# EasyEDA Pro project CFWatch EasyEDA.epro

# Schematic Main
Board Name: Watch; Create Date: 2025-07-10; Page Name: P1; Project Name: CFWatch EDA Version; Schematic Name: Main; Update Date: 2025-07-13; Company: https://danieldb.uk/; Page Size: A4; Version: V2.0
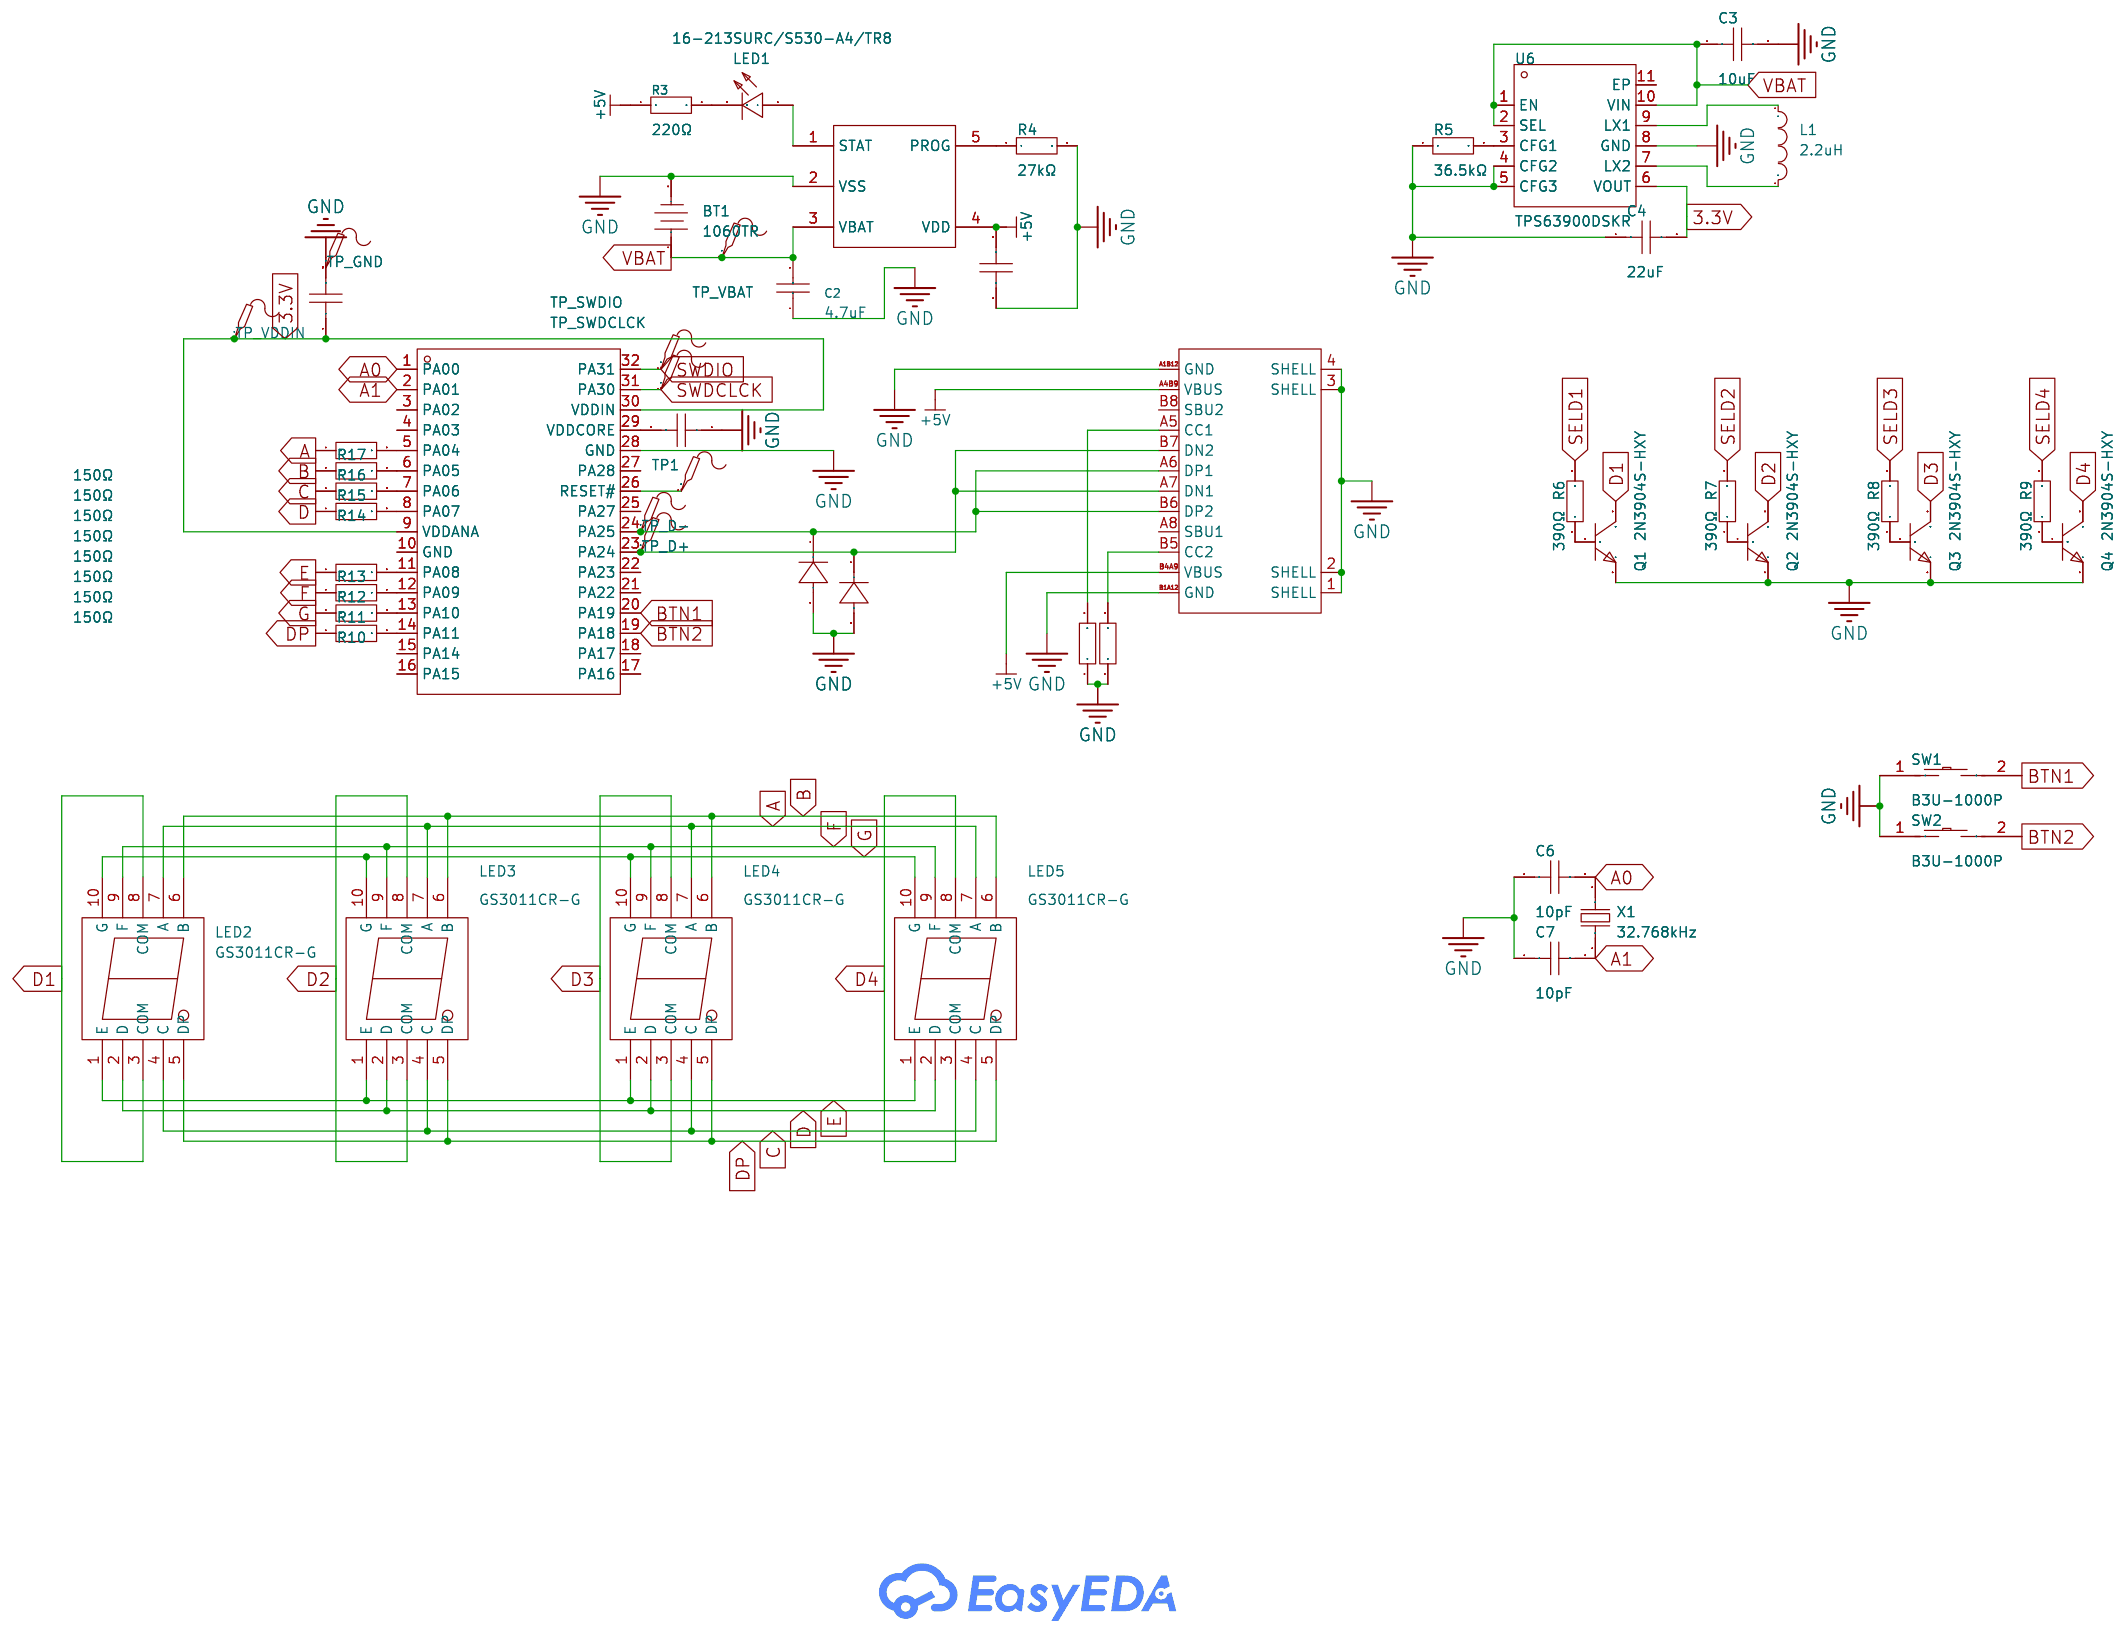
[diagram p0: schematic sheet]

## Parts
BT1  1060TR  [BAT-SMD_1060TR]
C1  1uF  [C0402]
C2  4.7uF  [C0402]
C3  10uF  [C0402]
C4  22uF  [C0402]
C5  1uF  [C0402]
C6  10pF  [C0402]
C7  10pF  [C0402]
C8  1uF  [C0402]
L1  2.2uH  [L0805]
LED1  16-213SURC/S530-A4/TR8  [LED0402-R-RD]
LED2  GS3011CR-G  [LED-SEG-SMD_10P-L12.0-W7.3-P1.50-BL]
LED3  GS3011CR-G  [LED-SEG-SMD_10P-L12.0-W7.3-P1.50-BL]
LED4  GS3011CR-G  [LED-SEG-SMD_10P-L12.0-W7.3-P1.50-BL]
LED5  GS3011CR-G  [LED-SEG-SMD_10P-L12.0-W7.3-P1.50-BL]
Q1  2N3904S-HXY  [SOT-23-3_L3.0-W1.7-P0.95-LS2.9-BR]
Q2  2N3904S-HXY  [SOT-23-3_L3.0-W1.7-P0.95-LS2.9-BR]
Q3  2N3904S-HXY  [SOT-23-3_L3.0-W1.7-P0.95-LS2.9-BR]
Q4  2N3904S-HXY  [SOT-23-3_L3.0-W1.7-P0.95-LS2.9-BR]
R1  5.1kΩ  [R0402]
R2  5.1kΩ  [R0402]
R3  220Ω  [R0402]
R4  27kΩ  [R0402]
R5  36.5kΩ  [R0402]
R6  390Ω  [R0402]
R7  390Ω  [R0402]
R8  390Ω  [R0402]
R9  390Ω  [R0402]
R10  150Ω  [R0402]
R11  150Ω  [R0402]
R12  150Ω  [R0402]
R13  150Ω  [R0402]
R14  150Ω  [R0402]
R15  150Ω  [R0402]
R16  150Ω  [R0402]
R17  150Ω  [R0402]
SW1  B3U-1000P  [KEY-SMD_B3U-1000PM]
SW2  B3U-1000P  [KEY-SMD_B3U-1000PM]
TP1  -  [Test-Point-0.5mm]
TP_D+  -  [Test-Point-0.5mm]
TP_D-  -  [Test-Point-0.5mm]
TP_GND  -  [Test-Point-0.5mm]
TP_SWDCLCK  -  [Test-Point-0.5mm]
TP_SWDIO  -  [Test-Point-0.5mm]
TP_VBAT  -  [Test-Point-0.5mm]
TP_VDDIN  -  [Test-Point-0.5mm]
U1  ATSAMD21E18A-AF  [TQFP-32_L7.0-W7.0-P0.80-LS9.0-BL]
U2  GT-USB-7010ASV  [USB-C-SMD_G-SWITCH_GT-USB-7010ASV]
U3  1N5819WS  [SOD-323_L1.8-W1.3-LS2.5-RD]
U4  1N5819WS  [SOD-323_L1.8-W1.3-LS2.5-RD]
U5  MCP73831T-2ATI/OT  [SOT-23-5_L3.0-W1.7-P0.95-LS2.8-BR]
U6  TPS63900DSKR  [WSON-10_L2.5-W2.5-W0.50-TL-EP]
X1  32.768kHz  [FC-135R_L3.2-W1.5]

## Library data of the parts
BT1 = 1060TR: Supplier Part: C238069; Manufacturer: Keystone; Supplier Footprint: SMD; JLCPCB Part Class: Extended Part; Datasheet: https://atta.szlcsc.com/upload/public/pdf/source/20230320/C1BE6CFA374F9ACD78161F1E1BA128C8.pdf; Supplier: LCSC
C1 C5 C8 = CL05A105KA5NQNC: Capacitance: Tolerance:±10% Tolerance:±10% Voltage Rated: Temperature Coefficient:; LCSC Part Name: 1uF ±10% 25V; Supplier Part: C52923; Manufacturer: SAMSUNG(三星); Supplier Footprint: 0402; JLCPCB Part Class: Basic Part; Datasheet: https://atta.szlcsc.com/upload/public/pdf/source/20160218/1457707763339.pdf; Supplier: LCSC; Tolerance: ±10%
C2 = CL05A475MP5NRNC: Capacitance: Tolerance:±20% Tolerance:±20% Voltage Rated: Temperature Coefficient:; LCSC Part Name: 4.7uF ±20% 10V; Supplier Part: C23733; Manufacturer: SAMSUNG(三星); Supplier Footprint: 0402; JLCPCB Part Class: Basic Part; Datasheet: https://atta.szlcsc.com/upload/public/pdf/source/20160218/1457707763339.pdf; Supplier: LCSC; Tolerance: ±20%
C3 = CGA0402X5R106M6R3GT: Capacitance:10uF Tolerance:±20% Tolerance:±20% Voltage Rating:6.3V Temperature Coefficient:X5R; LCSC Part Name: 10uF ±20% 6.3V; Supplier Part: C23692971; Manufacturer: HRE(芯声); Supplier Footprint: 0402; JLCPCB Part Class: Extended Part; Datasheet: https://atta.szlcsc.com/upload/public/pdf/source/20240628/801259D62E9C0558A4A5987807C4BB80.pdf; Supplier: LCSC; Tolerance: ±20%; Voltage Rating: 6.3V; Temperature Coefficient: X5R
C4 = GRM155R60J226ME11D: Capacitance:22uF Tolerance:±20% Tolerance:±20% Voltage Rating:6.3V Temperature Coefficient:X5R; LCSC Part Name: 22uF ±20% 6.3V; Supplier Part: C415703; Manufacturer: muRata(村田); Supplier Footprint: 0402; JLCPCB Part Class: Extended Part; Datasheet: https://atta.szlcsc.com/upload/public/pdf/source/20200305/C490387_23319AE8C154DEB24C505E6C82A8106A.pdf; Supplier: LCSC; Tolerance: ±20%; Voltage Rating: 6.3V; Temperature Coefficient: X5R
C6 C7 = CL05C100JB5NNNC: Capacitance: Tolerance:±5% Tolerance:±5% Voltage Rated: Temperature Coefficient:; LCSC Part Name: 10pF ±5% 50V; Supplier Part: C32949; Manufacturer: SAMSUNG(三星); Supplier Footprint: 0402; JLCPCB Part Class: Basic Part; Datasheet: https://atta.szlcsc.com/upload/public/pdf/source/20160218/1457707763339.pdf; Supplier: LCSC; Tolerance: ±5%
L1 = CMI201209U2R2KT: Inductance: Tolerance:±10% Tolerance:±10% Rated Current: Saturation Current (Isat):- DC Resistance (DCR): Q @ Freq:35@10MHz Frequency - Self Resonant: Ratings:; LCSC Part Name: 2.2uH ±10%; Supplier Part: C1043; Manufacturer: FH(风华); Supplier Footprint: 0805; JLCPCB Part Class: Extended Part; Datasheet: https://atta.szlcsc.com/upload/public/pdf/source/20230223/B5A9234764BD8EE53116685FAFCB16FA.pdf; Supplier: LCSC; Tolerance: ±10%; Q @ Freq: 35@10MHz
LED1 = 16-213SURC/S530-A4/TR8: Emitted Color:Red Power Dissipation:60mW Forward Current:20mA Dominant Wavelength:624nm Dominant Wavelength:624nm Peak Wavelength:632nm Diode Configuration:- Lens Color:无色透明透镜 Color Temperature:- Color Temperature:- Viewing Angle:120° Mounting Sytle:- Ope; LCSC Part Name: 红灯; Supplier Part: C74339; Manufacturer: EVERLIGHT(亿光); Supplier Footprint: 0402; JLCPCB Part Class: Extended Part; Datasheet: https://atta.szlcsc.com/upload/public/pdf/source/20160606/1465200212356.pdf; Supplier: LCSC; Emitted Color: Red; Power Dissipation: 60mW; Forward Current: 20mA; Dominant Wavelength: 624nm; Peak Wavelength: 632nm; Lens Color: 无色透明透镜; Viewing Angle: 120°; Operating Temperature: -40℃~+85℃
LED2-LED5 = GS3011CR-G: LCSC Part Name: LED贴片数码管; Supplier Part: C22462656; Manufacturer: Guangcai Display(光彩显示); Supplier Footprint: SMD,12x7.3mm; JLCPCB Part Class: Extended Part; Datasheet: https://atta.szlcsc.com/upload/public/pdf/source/20240611/2CC424320ED31D8FCA413C3BDF91AB39.pdf; Supplier: LCSC
Q1-Q4 = 2N3904S-HXY: Current - Collector(Ic):200mA Collector - Emitter Voltage VCEO:40V Pd - Power Dissipation:200mW DC Current Gain:300@10mA,1V DC Current Gain:300@10mA,1V Transition frequency(fT):300MHz Current - Collector Cutoff:100nA Vce Saturation(VCE(sat)):300mV@50mA,5m; Supplier Part: C46682376; Manufacturer: HXY MOSFET(华轩阳电子); Supplier Footprint: SOT-23; JLCPCB Part Class: Extended Part; Datasheet: https://atta.szlcsc.com/upload/public/pdf/source/20250320/D303C420EA3A961FEE131A42C1542DAF.pdf; Supplier: LCSC; Current - Collector(Ic): 200mA; Collector - Emitter Voltage VCEO: 40V; Pd - Power Dissipation: 200mW; DC Current Gain: 300@10mA,1V; Transition frequency(fT): 300MHz; Current - Collector Cutoff: 100nA; Vce Saturation(VCE(sat)): 300mV@50mA,5mA; Emitter-Base Voltage(Vebo): 6V
R1 R2 = 0402WGF5101TCE: Type:Thick Film Resistors Resistance:5.1kΩ Tolerance:±1% Tolerance:±1% Power(Watts): Overload Voltage (Max): Temperature Coefficient:±100ppm/℃ Temperature Coefficient:±100ppm/℃ Operating Temperature Range:-55℃~+155℃ Operating Temperature Range:-55℃~+155℃; LCSC Part Name: 5.1kΩ ±1% 62.5mW 厚膜电阻; Supplier Part: C25905; Manufacturer: UNI-ROYAL(厚声); Supplier Footprint: 0402; JLCPCB Part Class: Basic Part; Datasheet: https://atta.szlcsc.com/upload/public/pdf/source/20200306/C422600_1E6D84923E4A46A82E41ADD87F860B5C.pdf; Supplier: LCSC; Type: Thick Film Resistors; Tolerance: ±1%; Temperature Coefficient: ±100ppm/℃; Operating Temperature Range: -55℃~+155℃
R3 = 0402WGF2200TCE: Type:Thick Film Resistors Resistance: Tolerance:±1% Tolerance:±1% Power(Watts): Overload Voltage (Max): Temperature Coefficient:±100ppm/℃ Temperature Coefficient:±100ppm/℃ Operating Temperature Range:-55℃~+155℃ Operating Temperature Range:-55℃~+155℃; LCSC Part Name: 220Ω ±1% 62.5mW 厚膜电阻; Supplier Part: C25091; Manufacturer: UNI-ROYAL(厚声); Supplier Footprint: 0402; JLCPCB Part Class: Basic Part; Datasheet: https://atta.szlcsc.com/upload/public/pdf/source/20200306/C422600_1E6D84923E4A46A82E41ADD87F860B5C.pdf; Supplier: LCSC; Type: Thick Film Resistors; Tolerance: ±1%; Temperature Coefficient: ±100ppm/℃; Operating Temperature Range: -55℃~+155℃
R4 = 0402WGF2702TCE: Type:Thick Film Resistors Resistance:27kΩ Tolerance:±1% Tolerance:±1% Power(Watts): Overload Voltage (Max): Temperature Coefficient:±100ppm/℃ Temperature Coefficient:±100ppm/℃ Operating Temperature Range:-55℃~+155℃ Operating Temperature Range:-55℃~+155℃; LCSC Part Name: 27kΩ ±1% 62.5mW 厚膜电阻; Supplier Part: C25771; Manufacturer: UNI-ROYAL(厚声); Supplier Footprint: 0402; JLCPCB Part Class: Extended Part; Datasheet: https://atta.szlcsc.com/upload/public/pdf/source/20200306/C422600_1E6D84923E4A46A82E41ADD87F860B5C.pdf; Supplier: LCSC; Type: Thick Film Resistors; Tolerance: ±1%; Temperature Coefficient: ±100ppm/℃; Operating Temperature Range: -55℃~+155℃
R5 = RC0402FR-0736K5L: Type:Thick Film Resistors Resistance:36.5kΩ Tolerance:±1% Tolerance:±1% Power(Watts):62.5mW Voltage-Supply(Max):50V Temperature Coefficient:±100ppm/℃ Temperature Coefficient:±100ppm/℃ Operating Temperature:-55℃~+155℃ Operating Temperature:-55℃~+155℃; LCSC Part Name: 厚膜电阻 36.5kΩ ±1% 62.5mW; Supplier Part: C15011; Manufacturer: YAGEO(国巨); Supplier Footprint: 0402; JLCPCB Part Class: Extended Part; Datasheet: https://atta.szlcsc.com/upload/public/pdf/source/20170925/C131467_1506321478108990263.pdf; Supplier: LCSC; Type: Thick Film Resistors; Tolerance: ±1%; Power(Watts): 62.5mW; Voltage-Supply(Max): 50V; Temperature Coefficient: ±100ppm/℃; Operating Temperature: -55℃~+155℃
R6-R9 = RC0402FR-07390RL: Type:Thick Film Resistors Resistance: Tolerance:±1% Tolerance:±1% Power(Watts): Overload Voltage (Max): Temperature Coefficient:±100ppm/℃ Temperature Coefficient:±100ppm/℃ Operating Temperature Range:-55℃~+155℃ Operating Temperature Range:-55℃~+155℃; LCSC Part Name: 厚膜电阻 390Ω ±1% 62.5mW; Supplier Part: C137997; Manufacturer: YAGEO(国巨); Supplier Footprint: 0402; JLCPCB Part Class: Extended Part; Datasheet: https://atta.szlcsc.com/upload/public/pdf/source/20181009/C309620_DA5935B6E1D48212CB7A533FE518B3C2.pdf; Supplier: LCSC; Type: Thick Film Resistors; Tolerance: ±1%; Temperature Coefficient: ±100ppm/℃; Operating Temperature Range: -55℃~+155℃
R10-R17 = RC0402FR-07150RL: Type:Thick Film Resistors Resistance: Tolerance:±1% Tolerance:±1% Power(Watts): Overload Voltage (Max): Temperature Coefficient:±100ppm/℃ Temperature Coefficient:±100ppm/℃ Operating Temperature Range:-55℃~+155℃ Operating Temperature Range:-55℃~+155℃; LCSC Part Name: 厚膜电阻 150Ω ±1% 62.5mW; Supplier Part: C138054; Manufacturer: YAGEO(国巨); Supplier Footprint: 0402; JLCPCB Part Class: Extended Part; Datasheet: https://atta.szlcsc.com/upload/public/pdf/source/20180821/C275644_0D56F95EFF785E7D9A1FEF436B37DA78.pdf; Supplier: LCSC; Type: Thick Film Resistors; Tolerance: ±1%; Temperature Coefficient: ±100ppm/℃; Operating Temperature Range: -55℃~+155℃
SW1 SW2 = B3U-1000P_C231329: Circuit:SPST Actuator Style:Round Button Operating Force:153gf Mounting Style:Standing paste Switch Length:3mm Switch Width:2.5mm Switch Height:1.6mm Contact Current:50mA Voltage Rating (DC):12V With Lamp:- Pin Style:SMDSplicing Mechanical Life:- Operatin; LCSC Part Name: 3*2.5*1.6mm 立贴 轻触开关; Supplier Part: C231329; Manufacturer: OMRON(欧姆龙); Supplier Footprint: SMD,2.5x3mm; JLCPCB Part Class: Extended Part; Supplier: LCSC; Circuit: SPST; Actuator Style: Round Button; Operating Force: 153gf; Mounting Style: Standing paste; Switch Length: 3mm; Switch Width: 2.5mm; Switch Height: 1.6mm; Contact Current: 50mA; Voltage Rating (DC): 12V; Pin Style: SMDSplicing; Operating Temperature: -25℃~+70℃
TP1 TP_D+ TP_D- TP_GND TP_SWDCLCK TP_SWDIO TP_VBAT TP_VDDIN = Test-Point: Test Point 测试点
U1 = ATSAMD21E18A-AF_C618770: CPU Core:ARM-MSeries Program Storage Size:256KB GPIO Ports Number:26 Operating Voltage Range:1.62V~3.6V Operating Voltage Range:1.62V~3.6V CPU Maximum Speed:48MHz Operating Temperature Range:-40℃~+125℃ Operating Temperature Range:-40℃~+125℃ ADC (Bit):12bi; Supplier Part: C618770; Manufacturer: MICROCHIP(美国微芯); Supplier Footprint: TQFP-32(7x7); JLCPCB Part Class: Extended Part; Datasheet: https://atta.szlcsc.com/upload/public/pdf/source/20221014/F65C30D4DC53CEBA3C02B22F35E14B22.pdf; Supplier: LCSC; CPU Core: ARM-MSeries; Program Storage Size: 256KB; GPIO Ports Number: 26; Operating Voltage Range: 1.62V~3.6V; CPU Maximum Speed: 48MHz; Operating Temperature Range: -40℃~+125℃; ADC (Bit): 12bit; DAC (Bit): 10bit; Universal Serial Bus: 有; Watchdog: 有; Low-Voltage Detect: 有; Direct Memory Access: 有; Internal Oscillator: 有
U2 = GT-USB-7010ASV: Connector Type:Type-C Standard:USB 2.0 Gender:Female Mounting Style:Horizontal attachment Number of Contacts:16P Number of Ports:1 Current Rating - Power (Max):3A Rated Voltage (Max):24V Connect-Disconnect Life:10,000 times Center Height:1.68mm Length:7.3; LCSC Part Name: Type-C 母 卧贴; Supplier Part: C2988369; Manufacturer: G-Switch(品赞); Supplier Footprint: SMD; JLCPCB Part Class: Extended Part; Datasheet: https://atta.szlcsc.com/upload/public/pdf/source/20230327/DF227B64686AC8FA0AD1775797F2C3F1.pdf; Supplier: LCSC; Connector Type: Type-C; Standard: USB 2.0; Gender: Female; Mounting Style: Horizontal attachment; Number of Contacts: 16P; Number of Ports: 1; Current Rating - Power (Max): 3A; Rated Voltage (Max): 24V; Connect-Disconnect Life: 10,000 times; Center Height: 1.68mm; Length: 7.35mm; Core Colour: Black; Operating Temperature Range: -40℃~+85℃
U3 U4 = 1N5819WS_C5451629: Diode Configuration:Independent Type Forward Voltage (Vf@If):600mV@200mA Reverse Voltage (Vr):40V Rectified Current:350mA Reverse Leakage Current (Ir):5uA@30V; LCSC Part Name: 电压:40V 电流:350mA; Supplier Part: C5451629; Manufacturer: HXY MOSFET(华轩阳电子); Supplier Footprint: SOD-323; JLCPCB Part Class: Extended Part; Datasheet: https://atta.szlcsc.com/upload/public/pdf/source/20241210/E09529DC3911EEA68F8C7E42E992A25B.pdf; Supplier: LCSC; Diode Configuration: Independent Type; Forward Voltage (Vf@If): 600mV@200mA; Reverse Voltage (Vr): 40V; Rectified Current: 350mA; Reverse Leakage Current (Ir): 5uA@30V
U5 = MCP73831T-2ATI/OT: The Chip Type:- Voltage - Supply:3.75V~6V Voltage - Supply:3.75V~6V Charge Current - Max:- Charging Saturation Voltage:4.2V Type of Battery:Lithium-ion/Polymer Number of Cells:1 Number of Cells:1 Operating Temperature:-40℃~+85℃ Operating Temperature:-40℃~; Supplier Part: C14879; Manufacturer: MICROCHIP(美国微芯); Supplier Footprint: SOT-23-5; JLCPCB Part Class: Extended Part; Datasheet: https://atta.szlcsc.com/upload/public/pdf/source/20171228/C150772_15144473662971214910.pdf; Supplier: LCSC; Voltage - Supply: 3.75V~6V; Charging Saturation Voltage: 4.2V; Type of Battery: Lithium-ion/Polymer; Number of Cells: 1; Operating Temperature: -40℃~+85℃
U6 = TPS63900DSKR: Input Voltage:1.8V~5.5V Input Voltage:1.8V~5.5V Output Current:400mA Switching Frequency:- Switching Frequency:- Operating Temperature:-40℃~+125℃@(TJ) Operating Temperature:-40℃~+125℃@(TJ) Synchronous Rectification:Yes Number of Outputs:- Topology:Step-do; LCSC Part Name: 1.8V至5.5V,75nA超低静态电流同步升降压转换器; Supplier Part: C1518762; Manufacturer: TI(德州仪器); Supplier Footprint: WSON-10-EP(2.5x2.5); JLCPCB Part Class: Extended Part; Datasheet: https://www.ti.com/cn/lit/gpn/tps63900; Supplier: LCSC; Input Voltage: 1.8V~5.5V; Output Current: 400mA; Operating Temperature: -40℃~+125℃@(TJ); Synchronous Rectification: Yes; Topology: Step-down-Boost
X1 = Q13FC13500004_C32346: Crystal Type:Surface Mount Crystal Frequency: Normal temperature Frequency Tolerance:±20ppm Normal temperature Frequency Tolerance:±20ppm Load Capacitor: Equivalent Series Resistance (ESR):70kΩ Operating Temperature: Operating Temperature:; LCSC Part Name: 32.768kHz ±20ppm 12.5pF; Supplier Part: C32346; Manufacturer: EPSON(爱普生); Manufacturer Part: Q13FC13500004; Supplier Footprint: SMD3215-2P; JLCPCB Part Class: Basic Part; Datasheet: https://atta.szlcsc.com/upload/public/pdf/source/20240418/0E0FF5F0356BA3753F616001439D1416.pdf; Supplier: LCSC; Crystal Type: Surface Mount Crystal; Normal temperature Frequency Tolerance: ±20ppm; Equivalent Series Resistance (ESR): 70kΩ

## Nets
3.3V: C4.2 C5.1 TP_VDDIN.1 U1.9(VDDANA) U1.30(VDDIN) U6.6(VOUT)
+5V: C1.2 R3.1 U2.A4B9(VBUS) U2.B4A9(VBUS) U5.4(VDD)
GND: BT1.2(-) C1.1 C2.1 C3.2 C4.1 C5.2 C6.1 C7.1 C8.1 Q1.2(E) Q2.2(E) Q3.2(E) Q4.2(E) R1.1 R2.1 R4.2 R5.1 SW1.1 SW2.1 U1.28(GND) U2.1(SHELL) U2.2(SHELL) U2.3(SHELL) U2.4(SHELL) U2.A1B12(GND) U2.B1A12(GND) U3.2(A) U4.2(A) U5.2(VSS) U6.4(CFG2) U6.5(CFG3) U6.8(GND)
VBAT: BT1.1(+) C2.2 C3.1 TP_VBAT.1 U5.3(VBAT) U6.1(EN) U6.2(SEL) U6.10(VIN)
A: LED2.7(A) LED3.7(A) LED4.7(A) LED5.7(A) R17.1
A0: C6.2 U1.1(PA00) X1.2
A1: C7.2 U1.2(PA01) X1.1
B: LED2.6(B) LED3.6(B) LED4.6(B) LED5.6(B) R16.1
BTN1: SW1.2 U1.20(PA19)
BTN2: SW2.2 U1.19(PA18)
C: LED2.4(C) LED3.4(C) LED4.4(C) LED5.4(C) R15.1
D: LED2.2(D) LED3.2(D) LED4.2(D) LED5.2(D) R14.1
D1: LED2.3(COM) LED2.8(COM) Q1.3(C)
D2: LED3.3(COM) LED3.8(COM) Q2.3(C)
D3: LED4.3(COM) LED4.8(COM) Q3.3(C)
D4: LED5.3(COM) LED5.8(COM) Q4.3(C)
DP: LED2.5(DP) LED3.5(DP) LED4.5(DP) LED5.5(DP) R10.1
E: LED2.1(E) LED3.1(E) LED4.1(E) LED5.1(E) R13.1
F: LED2.9(F) LED3.9(F) LED4.9(F) LED5.9(F) R12.1
G: LED2.10(G) LED3.10(G) LED4.10(G) LED5.10(G) R11.1
SELD1: R6.2
SELD2: R7.2
SELD3: R8.2
SELD4: R9.2
SWDCLCK: TP_SWDCLCK.1 U1.31(PA30)
SWDIO: TP_SWDIO.1 U1.32(PA31)
$1N465: TP_D+.1 U1.23(PA24) U2.A7(DN1) U2.B7(DN2) U4.1(K)
$1N640: TP_D-.1 U1.24(PA25) U2.A6(DP1) U2.B6(DP2) U3.1(K)
$1N815: R1.2 U2.A5(CC1)
$1N820: R2.2 U2.B5(CC2)
$1N1606: LED1.1(A) U5.1(STAT)
$1N1727: LED1.2(C) R3.2
$1N1834: R4.1 U5.5(PROG)
$1N2220: L1.1 U6.9(LX1)
$1N2226: L1.2 U6.7(LX2)
$1N2443: R5.2 U6.3(CFG1)
$1N4175: R10.2 U1.14(PA11)
$1N4214: R11.2 U1.13(PA10)
$1N4253: R12.2 U1.12(PA09)
$1N4292: R13.2 U1.11(PA08)
$1N4331: R14.2 U1.8(PA07)
$1N4370: R15.2 U1.7(PA06)
$1N4409: R16.2 U1.6(PA05)
$1N4448: R17.2 U1.5(PA04)
$1N5046: TP1.1 U1.26(RESET#)
$1N5217: C8.2 U1.29(VDDCORE)
$1N8340: Q1.1(B) R6.1
$1N8386: Q2.1(B) R7.1
$1N8433: Q3.1(B) R8.1
$1N8480: Q4.1(B) R9.1

Not connected (* = marked no-connect by the designer): TP_GND 1; U1 3(PA02) 4(PA03) 10(GND) 15(PA14) 16(PA15) 17(PA16) 18(PA17) 21(PA22) 22(PA23) 25(PA27) 27(PA28); U2 A8(SBU1) B8(SBU2); U6 11(EP)

# Board PCB1
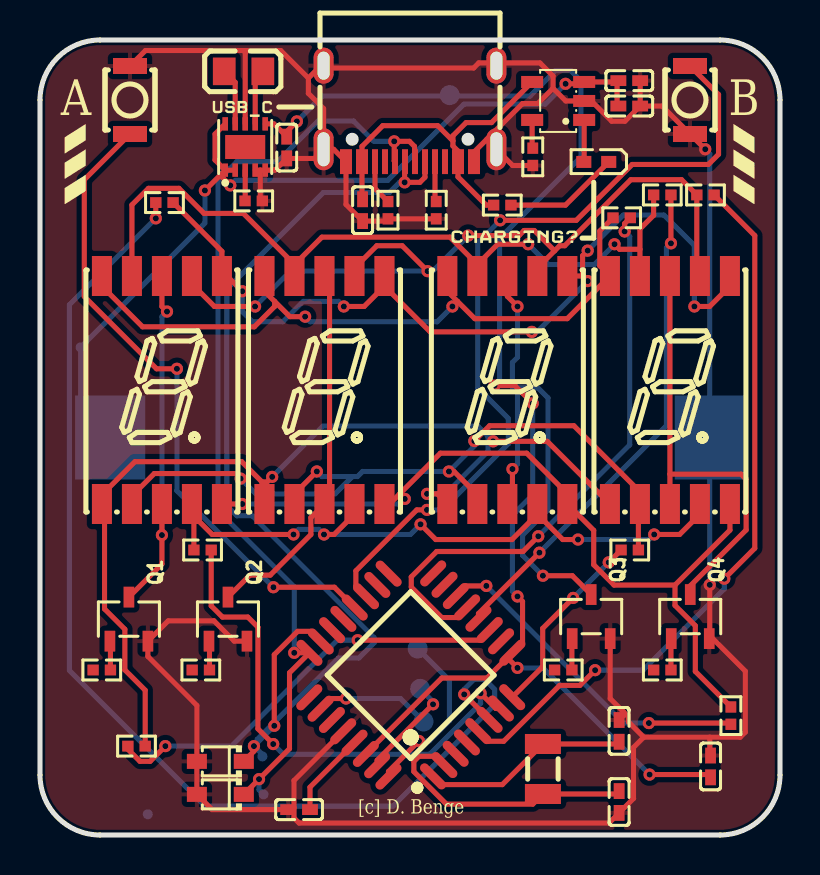
[diagram p1: board, top side]
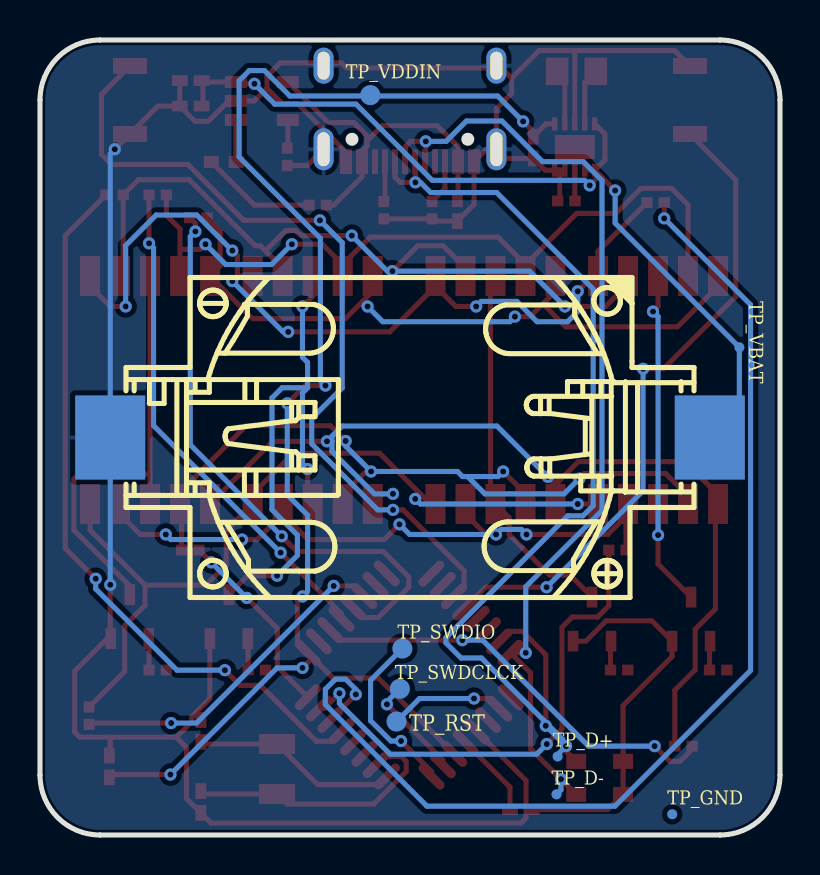
[diagram p2: board, bottom side, seen from below]

Outline 37 x 39.75 mm; copper layers: Top Layer, Bottom Layer. Coordinates in mm from the lower left corner of the outline.
Outline path: 0,36.75 0,3 arc(0.88,0.88) 3,0 34,0 arc(36.12,0.88) 37,3 37,36.75 arc(36.12,38.87) 34,39.75 3,39.75 arc(0.88,38.87) 0,36.75
Stack: Top Layer 0.035mm / Dielectric1 1.51mm FR4 er 4.5 / Bottom Layer 0.035mm

## Design rules (mm)
template: JLCPCB Capability(Two Layers Board)
spacing copperThickness1oz (default): track to track 0.102, other pairs 0.152 to 0.3
spacing copperThickness2oz: track to track 0.203, other pairs 0.152 to 0.3
track width copperThickness1oz (default): min 0.127, default 0.254, max 2.54
track width copperThickness2oz: min 0.203, default 0.254, max 2.54
differential pair differentialPair (default): width min 0.127, default 0.254, max 2.54; gap min 0.152, default 0.152
via viaSize (default): diameter min 0.5, default 0.61, max 10; hole min 0.3, default 0.305, max 6.3

## Placement (name value [footprint] x y rotation side)
BT1  1060TR  [BAT-SMD_1060TR]  18.5 19.88 90 bottom
C1  1uF  [C0402]  16.13 31.24 90 top
C2  4.7uF  [C0402]  29.46 37.72 180 top
C3  10uF  [C0402]  29.46 36.45 0 top
C4  22uF  [C0402]  12.34 34.37 90 top
C5  1uF  [C0402]  33.53 3.43 90 top
C6  10pF  [C0402]  28.96 5.21 270 top
C7  10pF  [C0402]  28.96 1.65 90 top
C8  1uF  [C0402]  12.95 1.27 0 top
L1  2.2uH  [L0805]  10.18 38.18 0 top
LED1  16-213SURC/S530-A4/TR8  [LED0402-R-RD]  27.81 33.65 180 top
LED2  GS3011CR-G  [LED-SEG-SMD_10P-L12.0-W7.3-P1.50-BL]  6.1 22.25 0 top
LED3  GS3011CR-G  [LED-SEG-SMD_10P-L12.0-W7.3-P1.50-BL]  14.22 22.25 0 top
LED4  GS3011CR-G  [LED-SEG-SMD_10P-L12.0-W7.3-P1.50-BL]  23.37 22.25 0 top
LED5  GS3011CR-G  [LED-SEG-SMD_10P-L12.0-W7.3-P1.50-BL]  31.5 22.25 0 top
Q1  2N3904S-HXY  [SOT-23-3_L3.0-W1.7-P0.95-LS2.9-BR]  4.44 10.79 270 top
Q2  2N3904S-HXY  [SOT-23-3_L3.0-W1.7-P0.95-LS2.9-BR]  9.4 10.79 270 top
Q3  2N3904S-HXY  [SOT-23-3_L3.0-W1.7-P0.95-LS2.9-BR]  27.56 10.92 270 top
Q4  2N3904S-HXY  [SOT-23-3_L3.0-W1.7-P0.95-LS2.9-BR]  32.51 10.92 270 top
R1  5.1kΩ  [R0402]  19.81 31.24 90 top
R2  5.1kΩ  [R0402]  17.4 31.24 90 top
R3  220Ω  [R0402]  23.11 31.5 0 top
R4  27kΩ  [R0402]  24.64 33.91 270 top
R5  36.5kΩ  [R0402]  10.69 31.71 180 top
R6  390Ω  [R0402]  3.09 8.25 180 top
R7  390Ω  [R0402]  8.04 8.25 180 top
R8  390Ω  [R0402]  26.16 8.25 180 top
R9  390Ω  [R0402]  31.12 8.25 180 top
R10  150Ω  [R0402]  34.54 5.97 270 top
R11  150Ω  [R0402]  29.08 30.86 0 top
R12  150Ω  [R0402]  31.12 32 0 top
R13  150Ω  [R0402]  4.83 4.44 180 top
R14  150Ω  [R0402]  29.49 14.25 180 top
R15  150Ω  [R0402]  8.13 14.25 0 top
R16  150Ω  [R0402]  6.22 31.62 180 top
R17  150Ω  [R0402]  33.27 32 0 top
SW1  B3U-1000P  [KEY-SMD_B3U-1000PM]  4.5 36.75 270 top
SW2  B3U-1000P  [KEY-SMD_B3U-1000PM]  32.5 36.75 90 top
TP1  -  [Test-Point-0.5mm#2]  19.17 5.67 180 bottom
TP_D+  -  [Test-Point-0.5mm]  11.12 3.93 180 bottom
TP_D-  -  [Test-Point-0.5mm]  11.18 2.03 180 bottom
TP_GND  -  [Test-Point-0.5mm]  5.39 1.04 180 bottom
TP_SWDCLCK  -  [Test-Point-0.5mm#2]  19.01 7.31 180 bottom
TP_SWDIO  -  [Test-Point-0.5mm#2]  18.88 9.32 180 bottom
TP_VBAT  -  [Test-Point-0.5mm]  2.03 24.38 270 bottom
TP_VDDIN  -  [Test-Point-0.5mm#2]  20.49 36.99 180 bottom
U1  ATSAMD21E18A-AF  [TQFP-32_L7.0-W7.0-P0.80-LS9.0-BL]  18.54 8 45 top
U2  GT-USB-7010ASV  [USB-C-SMD_G-SWITCH_GT-USB-7010ASV]  18.5 36.07 180 top
U3  1N5819WS  [SOD-323_L1.8-W1.3-LS2.5-RD]  9.02 2.03 180 top
U4  1N5819WS  [SOD-323_L1.8-W1.3-LS2.5-RD]  9.02 3.68 180 top
U5  MCP73831T-2ATI/OT  [SOT-23-5_L3.0-W1.7-P0.95-LS2.8-BR]  25.91 36.7 0 top
U6  TPS63900DSKR  [WSON-10_L2.5-W2.5-W0.50-TL-EP]  10.26 34.4 90 top
X1  32.768kHz  [FC-135R_L3.2-W1.5]  25.15 3.3 90 top

## Footprints (pads in the part's own frame, mm; a bottom-side part is the same pattern mirrored in y, then rotated)
BAT-SMD_1060TR
  rect 4.2x3.5 smd: 1(0,-14.988) 2(0,14.988)
C0402
  rect 0.79x0.54 smd: 1(-0.545,0) 2(0.545,0)
FC-135R_L3.2-W1.5
  rect 1x1.8 smd: 1(-1.25,0) 2(1.25,0)
KEY-SMD_B3U-1000PM
  rect 0.8x1.7 smd: 1(-1.7,0) 2(1.7,0)
L0805
  rect 1.133x1.377 smd: 1(-0.966,0) 2(0.966,0)
LED0402-R-RD
  rect 0.75x0.6 smd: 1(0.623,0) 2(-0.623,0)
LED-SEG-SMD_10P-L12.0-W7.3-P1.50-BL
  rect 1x2 smd: 1(-3,-5.7) 2(-1.5,-5.7) 3(0,-5.7) 4(1.5,-5.7) 5(3,-5.7) 6(3,5.7) 7(1.5,5.7) 8(0,5.7) 9(-1.5,5.7) 10(-3,5.7)
R0402
  rect 0.566x0.54 smd: 1(-0.433,0) 2(0.433,0)
SOD-323_L1.8-W1.3-LS2.5-RD
  rect 1x0.75 smd: 1(-1.173,0) 2(1.173,0)
SOT-23-3_L3.0-W1.7-P0.95-LS2.9-BR
  rect 1.038x0.532 smd: 1(1.101,-0.95) 2(1.101,0.95) 3(-1.101,0)
SOT-23-5_L3.0-W1.7-P0.95-LS2.8-BR
  rect 1.1x0.6 smd: 1(1.3,-0.95) 2(1.3,0) 3(1.3,0.95) 4(-1.3,0.95) 5(-1.3,-0.95)
Test-Point-0.5mm
  round 0.5 smd: 1(0,0)
Test-Point-0.5mm#2
  round 1 smd: 1(0,0)
TQFP-32_L7.0-W7.0-P0.80-LS9.0-BL
  oval 0.45x1.65 smd: 1(-2.8,-4.369) 2(-2,-4.369) 3(-1.2,-4.369) 4(-0.4,-4.369) 5(0.4,-4.369) 6(1.2,-4.369) 7(2,-4.369) 8(2.8,-4.369) 17(2.8,4.369) 18(2,4.369) 19(1.2,4.369) 20(0.4,4.369) 21(-0.4,4.369) 22(-1.2,4.369) 23(-2,4.369) 24(-2.8,4.369)
  oval 1.65x0.45 smd: 9(4.381,-2.8) 10(4.381,-2) 11(4.381,-1.2) 12(4.381,-0.4) 13(4.381,0.4) 14(4.381,1.2) 15(4.381,2) 16(4.381,2.8) 25(-4.381,2.8) 26(-4.381,2) 27(-4.381,1.2) 28(-4.381,0.4) 29(-4.381,-0.4) 30(-4.381,-1.2) 31(-4.381,-2) 32(-4.381,-2.8)
USB-C-SMD_G-SWITCH_GT-USB-7010ASV
  oval 1x2.1 hole 0.6x1.7: 1(-4.32,1.78) 2(4.32,1.78)
  oval 1x1.8 hole 0.6x1.4: 3(4.32,-2.4) 4(-4.32,-2.4)
  rect 0.6x1.24 smd: A1B12(-3.2,2.4) A4B9(-2.4,2.4) B1A12(3.2,2.4) B4A9(2.4,2.4)
  rect 0.3x1.24 smd: A5(-1.25,2.4) A6(-0.25,2.4) A7(0.25,2.4) A8(1.25,2.4) B5(1.75,2.4) B6(0.75,2.4) B7(-0.75,2.4) B8(-1.75,2.4)
WSON-10_L2.5-W2.5-W0.50-TL-EP
  rect 0.665x0.28 smd: 1(-1.157,1) 2(-1.157,0.5) 3(-1.157,0) 4(-1.157,-0.5) 5(-1.157,-1) 6(1.157,-1) 7(1.157,-0.5) 8(1.157,0) 9(1.157,0.5) 10(1.157,1)
  rect 1.2x2 smd: 11(0,0)

## Nets
As in the schematic.

Pads without a net: TP_GND 1; U1 3 4 10 15 16 17 18 21 22 25 27; U2 A8 B8; U6 11

## Via types
v1: diameter 0.61, hole 0.305, Top Layer to Bottom Layer, 72 vias

## Routing (per net, layer and track width the routed paths; a pad name or vN(x,y) marks a point on that pad's centre or on a via; arc(x,y) is an arc through that point)
3.3V: length 72.5
  Top Layer w0.254: 23.37,8.86 U1.9 24.13,9.63 24.13,11.67 v1(23.87,11.93) ; 23.37,8.86 22.35,7.85 20.09,7.85 U1.30 ; 23.37,8.86 v1(23.87,8.36) ; v1(24.64,21.58) 23.74,22.47 v1(22.73,22.47) ; v1(30.48,3.02) 33.39,3.02 C5.1 ; v1(12.84,35.68) 12.34,35.17 C4.2 11.7,35.56 U6.6
  Bottom Layer w0.254: 20.44,36.95 14.11,36.95 v1(12.84,35.68) ; 20.44,36.95 TP_VDDIN.1 ; 20.44,36.95 24.5,36.95 25.78,38.22 26.54,38.22 27.04,37.71 27.04,33.9 22.98,29.84 22.98,22.73 v1(22.73,22.47) ; v1(23.87,11.93) 23.62,12.18 23.62,15.99 24.64,17.01 v1(24.64,21.58) ; v1(23.87,8.36) 25.14,8.36 v1(30.48,3.02)
+5V: length 17.5
  Top Layer w0.254: U5.4 22.58,35.62 21.31,35.62 20.65,34.96 20.65,34.71 ; 20.65,34.71 20.65,34.45 20.9,34.2 U2.A4B9 20.9,32.91 22.31,31.5 R3.1 ; 20.65,34.71 19.88,35.47 17.14,35.47 16.1,34.43 U2.B4A9 16.1,31.81 C1.2
GND: length 152.6
  Top Layer w0.254: 14.06,38.35 13.93,38.35 13.42,37.84 ; 14.06,38.35 U2.3 ; 14.06,38.35 21.68,38.35 21.94,38.61 22.86,38.61 ; C3.2 31.1,36.45 SW2.1 v1(33.26,34.29) ; C3.2 29.25,35.69 28.59,35.69 27.57,36.7 U5.2 26.28,36.7 25.65,37.33 ; C3.2 C2.1 ; U2.4 22.86,38.5 22.86,38.61 ; 22.35,34.8 21.7,34.14 U2.A1B12 ; 22.35,34.8 22.35,34.76 U2.1 23.63,33.47 R4.2 ; 22.35,34.8 24.13,36.57 24.89,36.57 25.65,37.33 ; 25.65,37.33 25.65,37.95 25,38.61 22.86,38.61 ; 33.49,4.89 35.01,4.89 35.27,5.14 35.27,8.19 33.49,9.97 ; 33.49,4.89 33.49,4.01 C5.2 ; 33.49,4.89 30.19,4.89 ; 33.49,9.97 Q4.2 ; 33.49,9.97 v1(33.49,12.51) ; U6.8 10.26,39.11 10.37,39.22 ; R1.1 R2.1 17.29,30.7 C1.1 15.3,31.53 U2.B1A12 14.68,34.29 U2.2 ; 13.42,37.84 13.42,37.08 14.18,36.32 U2.2 ; 13.42,37.84 12.04,39.22 10.37,39.22 ; 30.19,4.89 29.42,5.65 29.42,5.91 29.17,6.16 ; 30.19,4.89 29.68,4.38 29.68,1.83 28.96,1.1 28.45,0.6 12.95,0.6 12.7,0.85 12.7,1.36 ; 29.17,6.16 29.17,5.97 C6.1 ; 29.17,6.16 28.51,6.82 Q3.2 ; U6.4 11.01,33.24 ; 11.01,33.24 11.01,31.81 R5.1 ; 11.01,33.24 U6.5 11.75,33.24 C4.1 13.72,33.83 U2.2 ; 12.7,1.36 12.5,1.36 12.41,1.27 8.61,1.27 U3.2 U4.2 7.84,6.48 5.4,8.93 5.4,9.69 6.41,10.71 8.7,10.71 9.71,9.69 Q2.2 ; 12.7,1.36 12.7,2.72 U1.28 ; 10.37,39.22 5.27,39.22 SW1.1
  Bottom Layer w0.254: v1(33.49,12.51) BT1.2 33.49,34.06 v1(33.26,34.29)
VBAT: length 43.7
  Top Layer w0.254: 28.85,37.65 C2.2 ; 28.85,37.65 U5.3 27.12,37.56 v1(26.28,37.56) ; 28.85,37.65 28.85,36.51 C3.1 ; U6.10 8.75,35.05 8.75,33.75 U6.1 ; U6.1 U6.2 ; U6.1 9.01,32.99 ; 9.01,32.99 v1(9.51,32.48) ; 9.01,32.99 v1(8.24,32.23)
  Bottom Layer w0.254: v1(9.51,32.48) 9.77,32.73 17.39,32.73 21.2,36.54 25.26,36.54 v1(26.28,37.56) ; BT1.1 2.03,21.36 TP_VBAT.1 8.24,30.6 v1(8.24,32.23)
A: length 40.7
  Top Layer w0.254: LED2.7 7.71,27.84 7.71,27.44 8.72,26.43 v1(10.75,26.43) ; 25.73,29.21 24.71,30.22 24.21,30.22 23.95,29.97 v1(21.41,29.97) ; 25.73,29.21 25.98,29.46 26.24,29.46 29.54,32.77 32.08,32.77 R17.1 32.84,28.11 LED5.7 ; 25.73,29.21 24.87,28.35 LED4.7 ; v1(19.38,28.19) 18.11,29.46 16.84,29.46 15.72,28.35 LED3.7
  Bottom Layer w0.254: v1(10.75,26.43) 12.52,28.19 v1(19.38,28.19) 19.63,28.19 v1(21.41,29.97)
A0: length 10.4
  Top Layer w0.254: U1.1 20.06,2.52 23.11,2.52 X1.2 28.85,4.55 C6.2
A1: length 13.5
  Top Layer w0.254: 20.22,3.5 19.78,3.93 18.95,3.93 18.69,3.68 18.69,3.17 20.32,1.54 24.64,1.54 X1.1 28.81,2.05 28.96,2.19
B: length 42.9
  Top Layer w0.254: v1(15.19,26.43) 16.21,26.43 17.22,27.44 ; 27.13,27.95 LED4.6 ; 27.13,27.95 v1(27.38,27.7) ; 27.13,27.95 27.13,28.97 v1(27.38,29.22) ; v1(10.11,27.19) 9.35,27.95 LED2.6 9.1,29.18 R16.1 ; 17.22,27.44 19.51,25.16 v1(24.59,25.16) ; 17.22,27.44 LED3.6 ; LED5.6 34.5,27.44 33.48,26.43 v1(32.72,26.43)
  Bottom Layer w0.254: v1(27.38,27.7) 24.84,25.16 v1(24.59,25.16) ; v1(32.72,26.43) 32.72,29.47 31.19,31 29.16,31 v1(27.38,29.22) ; v1(10.11,27.19) 10.11,26.17 10.62,25.66 12.14,25.66 13.16,26.68 14.94,26.68 v1(15.19,26.43)
BTN1: length 32.6
  Top Layer w0.254: v1(11.67,12.39) 14.72,12.39 U1.20 ; SW1.2 2.21,32.76 2.21,26.93 5.83,23.31 v1(6.85,23.31)
  Bottom Layer w0.254: v1(6.85,23.31) 6.85,17.21 v1(11.67,12.39)
BTN2: length 41.3
  Top Layer w0.254: U1.19 15.79,12.45 15.79,13.21 18.84,16.26 v1(19.35,16.26) ; SW2.2 33.93,37.02 33.93,34.04 33.42,33.53 29.61,33.53 26.82,30.73 v1(23.01,30.73)
  Bottom Layer w0.254: v1(23.01,30.73) 21.89,29.62 21.89,22.35 23.41,20.83 23.41,19.56 20.11,16.26 v1(19.35,16.26)
C: length 34.5
  Top Layer w0.254: 24.87,16.04 LED4.4 ; 24.87,16.04 26.14,14.77 v1(26.9,14.77) ; 24.87,16.04 23.6,14.77 19.79,14.77 v1(19.03,15.53) ; v1(12.68,15.03) 8.61,15.03 7.69,15.94 ; 7.69,15.94 7.69,16.45 LED2.4 7.6,16.04 7.69,15.94 ; 7.69,15.94 R15.1 ; v1(14.2,15.03) 14.71,15.03 15.72,16.04 LED3.4 ; LED5.4 33,16.04 31.98,15.03 v1(30.71,15.03)
  Bottom Layer w0.254: v1(12.68,15.03) 12.93,15.28 13.95,15.28 v1(14.2,15.03) 18.52,15.03 v1(19.03,15.53) ; v1(30.71,15.03) 30.46,14.77 v1(26.9,14.77)
D: length 38.9
  Top Layer w0.254: 29.92,16.47 29.92,17.24 26.69,20.46 22.48,20.46 v1(21.72,19.7) ; 29.92,16.47 LED5.2 ; 29.92,16.47 R14.1 ; v1(13.84,18.18) 12.72,17.06 LED3.2 ; v1(10.03,17.82) 9.78,18.07 5.71,18.07 4.6,16.96 LED2.2 ; v1(20.45,18.18) 20.7,18.18 21.87,17.01 LED4.2
  Bottom Layer w0.254: 15.62,17.92 15.87,17.92 16.13,18.18 v1(20.45,18.18) 21.72,19.45 v1(21.72,19.7) ; 15.62,17.92 14.1,17.92 v1(13.84,18.18) ; 15.62,17.92 14.76,17.06 10.79,17.06 v1(10.03,17.82)
D1: length 18.5
  Top Layer w0.254: v1(6.35,26.17) 6.1,26.43 LED2.8 ; Q1.3 6.1,13.55 v1(6.1,15) LED2.3
  Bottom Layer w0.254: v1(6.1,15) 6.1,25.92 v1(6.35,26.17)
D2: length 18.9
  Top Layer w0.254: Q2.3 10.5,12.99 11.51,12.99 13.54,15.03 13.54,15.87 LED3.3 14.48,16.8 14.48,27.7 LED3.8
D3: length 26.7
  Top Layer w0.254: Q3.3 26.62,12.96 v1(25.15,12.96) ; LED4.3 23.62,16.8 v1(23.62,18.3) ; v1(23.88,26.43) 23.37,26.93 LED4.8
  Bottom Layer w0.254: 23.62,22.36 24.89,22.36 25.4,21.85 25.4,16.27 24.13,15 24.13,13.98 v1(25.15,12.96) ; 23.62,22.36 23.62,23.63 23.88,23.89 v1(23.88,26.43) ; 23.62,22.36 23.88,22.11 23.88,18.55 v1(23.62,18.3)
D4: length 22.2
  Top Layer w0.254: 31.5,18.04 LED5.3 ; 31.5,18.04 35.05,18.04 35.31,17.79 35.31,15.25 32.51,12.46 Q4.3 ; 31.5,18.04 LED5.8
DP: length 41.7
  Top Layer w0.254: R10.1 32.77,8.18 32.77,10.47 31.75,11.48 31.75,12.5 ; 17.99,17.06 20.02,19.09 24.34,19.09 26.37,17.06 LED4.5 27.69,15.23 27.69,13.51 28.7,12.5 31.75,12.5 ; 17.99,17.06 17.48,16.55 LED3.5 ; 17.99,17.06 v1(18.24,16.8) ; 31.75,12.5 34.5,15.24 LED5.5 ; v1(10.11,16.55) LED2.5
  Bottom Layer w0.254: v1(18.24,16.8) 17.99,16.55 v1(10.11,16.55)
E: length 49.8
  Top Layer w0.254: 11.1,17.65 11.1,16.67 LED3.1 ; 11.1,17.65 11.35,17.65 v1(11.61,17.91) ; 11.1,17.65 10.09,18.67 4.75,18.67 3.23,17.14 3.23,16.38 ; v1(22.65,19.68) 25.36,19.68 LED5.1 ; 3.23,16.38 3.23,11.3 4.24,10.29 4.24,8.25 5.26,7.24 R13.1 ; 3.23,16.38 LED2.1 ; v1(19.35,17.06) 19.86,17.06 LED4.1
  Bottom Layer w0.254: v1(11.61,17.91) 14.15,20.45 21.89,20.45 22.4,19.94 22.4,19.68 ; 22.4,19.68 22.4,19.18 20.28,17.06 v1(19.35,17.06) ; 22.4,19.68 v1(22.65,19.68)
F: length 38.9
  Top Layer w0.254: 21.87,28.52 LED4.9 ; 21.87,28.52 22.88,29.54 v1(24.41,29.54) ; 21.87,28.52 20.5,29.89 14.09,29.89 12.72,28.52 ; 30,29.28 28.98,29.28 v1(28.73,29.54) ; 30,29.28 30,30.3 30.68,30.99 R12.1 ; 30,29.28 LED5.9 ; 12.72,28.52 LED3.9 ; 12.72,28.52 10.17,31.08 8.2,31.08 6.95,32.33 5.42,32.33 4.6,31.51 LED2.9
  Bottom Layer w0.254: v1(28.73,29.54) 27.71,28.52 25.42,28.52 v1(24.41,29.54)
G: length 35.9
  Top Layer w0.254: v1(13.26,25.92) 12.49,25.92 11.73,26.68 ; 11.73,26.68 11.22,27.19 LED3.10 ; 11.73,26.68 11.73,26.43 10.72,25.41 5.13,25.41 3.1,27.44 LED2.10 ; 20.88,26.68 21.74,25.82 26.36,25.82 LED5.10 27.99,28.46 27.99,30.2 R11.1 ; 20.88,26.68 20.37,27.19 LED4.10 ; 20.88,26.68 v1(20.62,26.43)
  Bottom Layer w0.254: v1(13.26,25.92) 13.51,25.66 19.86,25.66 v1(20.62,26.43)
SWDCLCK: length 5.2
  Top Layer w0.254: v1(19.65,6.54) 16.86,3.74 U1.31
  Bottom Layer w0.254: TP_SWDCLCK.1 19.65,6.66 v1(19.65,6.54)
SWDIO: length 8.6
  Top Layer w0.254: v1(18.95,4.7) 17.42,3.18 U1.32
  Bottom Layer w0.254: v1(18.95,4.7) 19.46,4.7 20.47,5.72 20.47,7.73 TP_SWDIO.1
$1N465: length 53.3
  Top Layer w0.254: v1(10.7,4.44) 10.7,4.19 U4.1 ; 14.04,9.67 13.53,10.18 12.88,10.18 11.71,9.02 v1(11.71,5.46) ; U2.B7 19.25,32.89 18.99,32.63 v1(18.23,32.63) 18.23,33.65 U2.A7
  Bottom Layer w0.254: 10.87,4.28 10.87,4.61 ; 10.87,4.28 v1(10.7,4.44) 10.87,4.61 ; 10.87,4.28 11.12,4.02 TP_D+.1 ; 10.87,4.61 v1(11.71,5.46) ; 10.87,4.61 10.87,4.78 14.93,8.85 15.94,8.85 16.71,9.61 16.71,9.86 10.61,15.96 9.85,15.96 9.34,16.47 9.34,27.3 14.17,32.12 17.47,32.12 17.98,32.63 v1(18.23,32.63)
$1N640: length 48.6
  Top Layer w0.254: U3.1 v1(10.95,2.79) 12.48,4.32 12.48,8.11 U1.24 v1(12.71,9.11) ; U2.A6 18.73,33.69 18.73,34.43 18.47,34.68 v1(17.71,34.68) 17.71,33.71 U2.B6
  Bottom Layer w0.254: v1(17.71,34.68) 16.69,34.68 15.68,35.7 13.9,35.7 11.87,33.67 9.84,33.67 8.9,32.73 8.9,16.22 12.71,12.41 v1(12.71,9.11) ; v1(10.95,2.79) 10.95,2.26 TP_D-.1
$1N815: length 2
  Top Layer w0.254: R1.2 19.75,31.74 U2.A5
$1N820: length 2.3
  Top Layer w0.254: U2.B5 16.75,32.32 R2.2
$1N1606: length 2.1
  Top Layer w0.254: U5.1 27.21,33.67 LED1.1
$1N1727: length 5.8
  Top Layer w0.254: LED1.2 26.28,31.5 R3.2
$1N1834: length 1.4
  Top Layer w0.254: U5.5 24.61,34.37 R4.1
$1N2220: length 2.9
  Top Layer w0.254: U6.9 9.76,37.63 L1.1
$1N2226: length 2.8
  Top Layer w0.254: U6.7 10.76,37.8 L1.2
$1N2443: length 1.5
  Top Layer w0.254: R5.2 10.26,31.71 U6.3
$1N4175: length 16.8
  Top Layer w0.254: U1.14 21.3,12.45 v1(22.32,12.45) ; R10.2 34.48,5.6 v1(30.44,5.6)
  Bottom Layer w0.254: v1(22.32,12.45) 29.17,5.6 v1(30.44,5.6)
$1N4214: length 29.4
  Top Layer w0.254: v1(29.23,30.18) 29.23,30.58 R11.2 ; v1(24.91,14.94) 24.15,14.17 19.83,14.17 18.56,12.91 18.56,12.4 20.09,10.87 20.85,10.87 U1.13
  Bottom Layer w0.254: v1(24.91,14.94) 29.49,19.51 29.49,29.92 v1(29.23,30.18)
$1N4253: length 25.2
  Top Layer w0.254: v1(31.55,29.58) R12.2 ; U1.12 21.92,11.07 v1(24.97,14.12)
  Bottom Layer w0.254: v1(24.97,14.12) 31.32,20.47 31.32,29.36 v1(31.55,29.58)
$1N4292: length 21.2
  Top Layer w0.254: v1(15.88,9.74) 21.98,9.74 U1.11 ; R13.2 4.39,4.29 5,3.68 5.51,3.68 v1(6.27,4.44)
  Bottom Layer w0.254: v1(15.88,9.74) 14.87,9.74 9.57,4.44 v1(6.27,4.44)
$1N4331: length 9.6
  Top Layer w0.254: v1(26.66,11.85) 25.13,10.33 25.13,8.41 U1.8 ; v1(28.44,13.63) R14.2
  Bottom Layer w0.254: v1(26.66,11.85) v1(28.44,13.63)
$1N4370: length 25.2
  Top Layer w0.254: v1(11.66,4.55) 10.9,5.31 10.9,10.39 10.39,10.9 9.12,10.9 8.56,11.46 R15.2 ; v1(22.03,7.09) 22.79,6.33 23.05,6.33
  Bottom Layer w0.254: v1(22.03,7.09) 22.03,6.58 19.49,4.04 12.17,4.04 v1(11.66,4.55)
$1N4409: length 56.1
  Top Layer w0.254: v1(5.79,30.83) R16.2 ; U1.6 v1(21.21,7.03)
  Bottom Layer w0.254: v1(21.21,7.03) 21.21,7.28 21.72,7.79 22.23,7.79 22.73,7.28 22.73,6.52 17.65,1.44 8.26,1.44 1.47,8.22 1.47,26.51 v1(5.79,30.83)
$1N4448: length 36.8
  Top Layer w0.254: U1.5 22.42,4.69 23.18,4.69 25.98,7.48 26.99,7.48 v1(27.76,8.24) ; R17.2 35.74,29.97 35.74,14.34 v1(34.22,12.81)
  Bottom Layer w0.254: v1(27.76,8.24) 30.15,8.24 34.22,12.31 v1(34.22,12.81)
$1N5046: length 5.8
  Top Layer w0.254: v1(15.3,6.82) 14.54,6.82 U1.26
  Bottom Layer w0.254: TP1.1 18.02,6.82 v1(15.3,6.82)
$1N5217: length 4.3
  Top Layer w0.254: U1.29 13.5,2.39 C8.2
$1N8340: length 1.5
  Top Layer w0.254: R6.1 3.52,9.67 Q1.1
$1N8386: length 1.5
  Top Layer w0.254: R7.1 8.47,9.67 Q2.1
$1N8433: length 1.6
  Top Layer w0.254: R8.1 26.59,9.81 Q3.1
$1N8480: length 1.6
  Top Layer w0.254: Q4.1 31.55,9.81 R9.1

## Copper pours and planes (outline as drawn; the poured copper is in the pictures)
GND on Top Layer: 0,39.75 37,39.75 37,0 0,0
GND on Bottom Layer: 0,39.75 37,39.75 37,0 0,0

## Text on the board
Bottom Silkscreen Layer: TP_RST
Top Silkscreen Layer: [c] D. Benge | A | B
